# Altium schematic sheet G11_GPS-GSM.SCHDOC
size A3; SheetNumber: 0; SheetTotal: 0
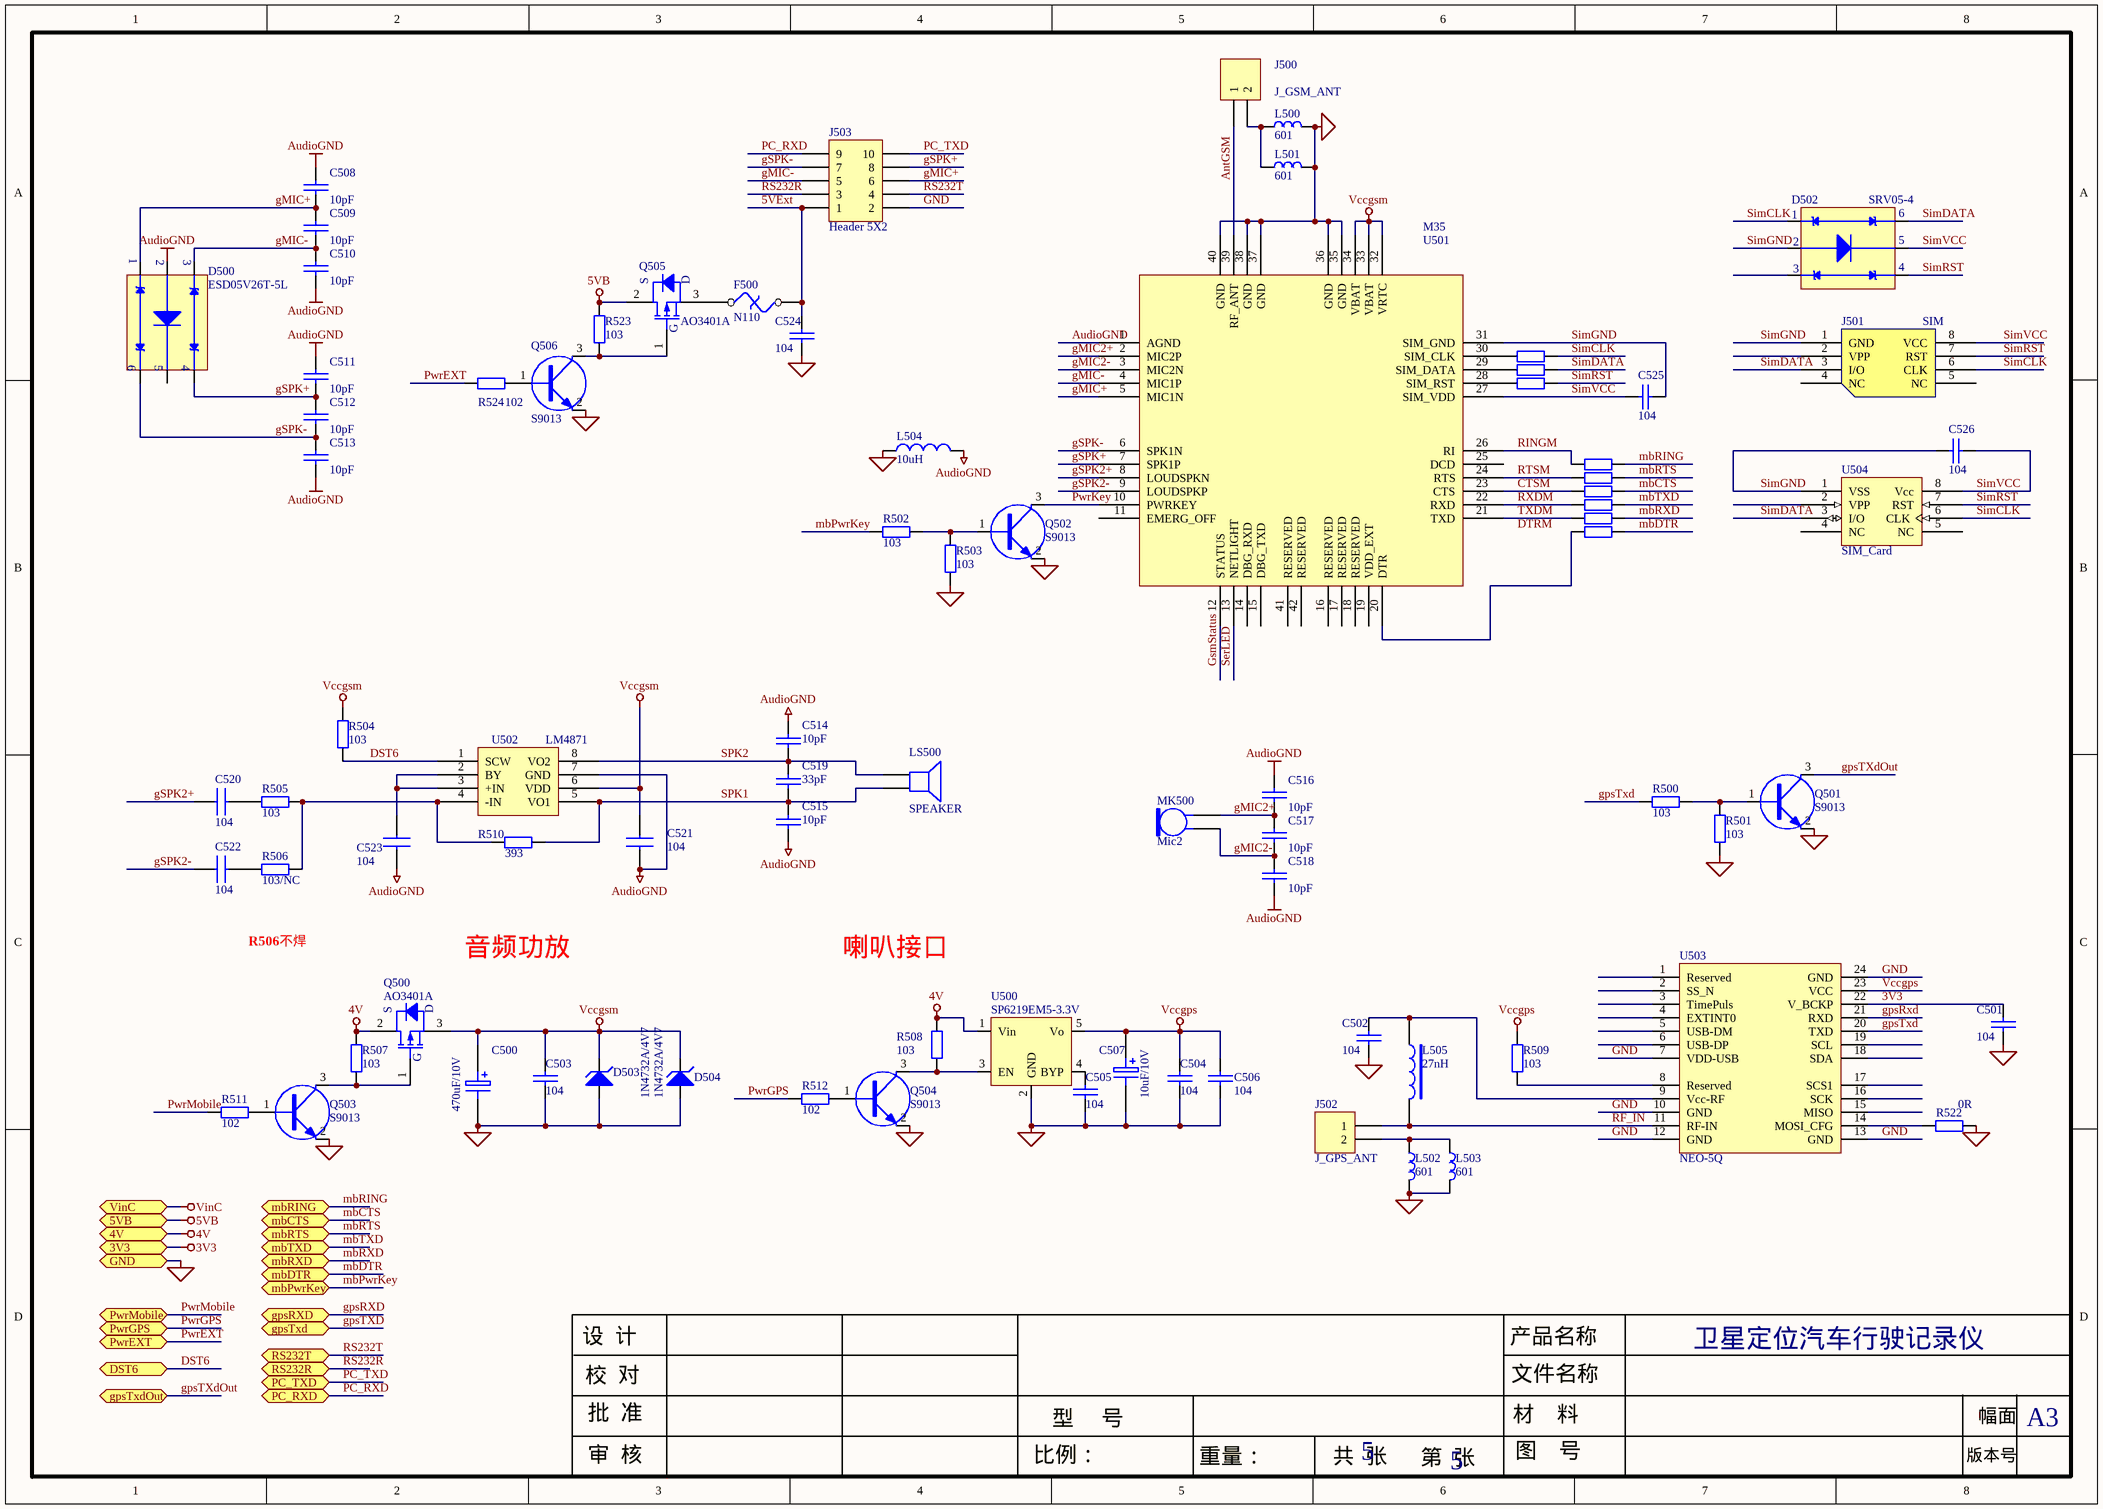
[diagram p0: G11_GPS-GSM.SCHDOC]

## Parts
C500  470uF/10V  [RB-3.5mm]
C501  104  [C0603]
C502  104  [C0603]
C503  104  [C0603]
C504  104  [C0603]
C505  104  [C0603]
C506  104  [C0603]
C507  10uF/10V  [A(3216)]
C508  10pF  [C0603]
C509  10pF  [C0603]
C510  10pF  [C0603]
C511  10pF  [C0603]
C512  10pF  [C0603]
C513  10pF  [C0603]
C514  10pF  [C0603]
C515  10pF  [C0603]
C516  10pF  [C0603]
C517  10pF  [C0603]
C518  10pF  [C0603]
C519  33pF  [C0603]
C520  104  [C0603]
C521  104  [C0603]
C522  104  [C0603]
C523  104  [C0603]
C524  104  [C0603]
C525  104  [C0603]
C526  104  [C0603]
D500  ESD05V26T-5L  [SOT-236]
D502  SRV05-4  [SOT-236]
D503  1N4732A/4V7  [D1206]
D504  1N4732A/4V7  [D1206]
F500  N110  [F0820]
J500  J_GSM_ANT  [ANT-SMA]
J501  SIM  [SIM3-8P]
J502  J_GPS_ANT  [ANT-SMA]
J503  Header 5X2  [HDR2X5-3MM]
L500  601  [0603]
L501  601  [0603]
L502  601  [0603]
L503  601  [0603]
L504  10uH  [0603]
L505  27nH  [0603]
LS500  SPEAKER  [BT-2.0]
MK500  Mic2  [BT-2.0]
Q500  AO3401A  [SOT-233PM]
Q501  S9013  [SOT-233]
Q502  S9013  [SOT-233]
Q503  S9013  [SOT-233]
Q504  S9013  [SOT-233]
Q505  AO3401A  [SOT-233PM]
Q506  S9013  [SOT-233]
R500  103  [R0603]
R501  103  [R0603]
R502  103  [R0603]
R503  103  [R0603]
R504  103  [R0603]
R505  103  [R0603]
R506  103/NC  [R0603]
R507  103  [R0603]
R508  103  [R0603]
R509  103  [R0603]
R510  393  [R0603]
R511  102  [R0603]
R512  102  [R0603]
R513  18R  [R0603]  (value not drawn)
R514  18R  [R0603]  (value not drawn)
R515  18R  [R0603]  (value not drawn)
R516  471  [R0603]  (value not drawn)
R517  471  [R0603]  (value not drawn)
R518  471  [R0603]  (value not drawn)
R519  471  [R0603]  (value not drawn)
R520  471  [R0603]  (value not drawn)
R521  471  [R0603]  (value not drawn)
R522  0R  [R0603]
R523  103  [R0603]
R524  102  [R0603]
U500  SP6219EM5-3.3V  [SOT-235]
U501  M35  [M35]
U502  LM4871  [SMD8A]
U503  NEO-5Q  [NEO-5Q]
U504  SIM_Card  [QFN5*6-8]

## Ports
3V3 (bidir), 4V (bidir), 5VB (bidir), DST6 (bidir), GND (bidir), gpsRXD (bidir), gpsTxd (bidir), gpsTxdOut (bidir), mbCTS (bidir), mbDTR (bidir), mbPwrKey (bidir), mbRING (bidir), mbRTS (bidir), mbRXD (bidir), mbTXD (bidir), PC_RXD (bidir), PC_TXD (bidir), PwrEXT (bidir), PwrGPS (bidir), PwrMobile (bidir), RS232R (bidir), RS232T (bidir), VinC (bidir)

## Nets
3V3: C501.1 U503.22(V_BCKP) ; port 3V3
4V: Q500.2(D) R507.1 R508.2 U500.1(Vin) ; port 4V
5VB: Q505.2(D) R523.1 ; port 5VB
AudioGND: C508.1 C510.2 C511.1 C513.2 C514.2 C515.1 C516.1 C518.2 C521.2 C523.2 D500.2 L504.2 U501.1(AGND) U502.7(GND)
GND: C500.2 C501.2 C502.2 C503.2 C504.2 C505.2 C506.1 C507.2 C524.2 D503.1(A) D504.1(A) J503.2 L500.2 L501.2 L502.2 L503.2 L504.1 Q501.2(E) Q502.2(E) Q503.2(E) Q504.2(E) Q506.2(E) R501.1 R503.1 R522.1 U500.2(GND) U501.35(GND) U501.36(GND) U501.37(GND) U501.38(GND) U501.40(GND) U503.7(VDD-USB) U503.10(GND) U503.12(GND) U503.13(GND) U503.24(GND) ; port GND
Vccgps: C504.1 C506.2 C507.1 R509.2 U500.5(Vo) U503.23(VCC)
Vccgsm: C500.1 C503.1 C521.1 D503.2(K) D504.2(K) Q500.3(S) R504.1 U501.32(VRTC) U501.33(VBAT) U501.34(VBAT) U502.6(VDD)
VinC: port VinC
5VExt: C524.1 F500.1 J503.1
AntGSM: J500.1 U501.39(RF_ANT)
CTSM: R518.1 U501.23(CTS)
DST6: R504.2 U502.1(SCW) ; port DST6
gMIC2+: C516.2 C517.1 MK500.1 U501.2(MIC2P)
gMIC2-: C517.2 C518.1 MK500.2 U501.3(MIC2N)
gMIC+: C508.2 C509.1 D500.1 J503.6 U501.5(MIC1N)
gMIC-: C509.2 C510.1 D500.3 J503.5 U501.4(MIC1P)
gpsRxd: U503.21(RXD) ; port gpsRXD
gpsTxd: R500.2 U503.20(TXD) ; port gpsTxd
gpsTXdOut: Q501.3(C) ; port gpsTxdOut
GsmStatus: U501.12(STATUS)
gSPK2+: C520.1 U501.8(LOUDSPKN)
gSPK2-: C522.1 U501.9(LOUDSPKP)
gSPK+: C511.2 C512.1 D500.4 J503.8 U501.7(SPK1P)
gSPK-: C512.2 C513.1 D500.6 J503.7 U501.6(SPK1N)
mbCTS: R518.2 ; port mbCTS
mbDTR: R521.2 ; port mbDTR
mbPwrKey: R502.2 ; port mbPwrKey
mbRING: R516.2 ; port mbRING
mbRTS: R517.2 ; port mbRTS
mbRXD: R520.2 ; port mbRXD
mbTXD: R519.2 ; port mbTXD
PC_RXD: J503.9 ; port PC_RXD
PC_TXD: J503.10 ; port PC_TXD
PwrEXT: R524.2 ; port PwrEXT
PwrGPS: R512.2 ; port PwrGPS
PwrKey: Q502.3(C) U501.10(PWRKEY)
PwrMobile: R511.2 ; port PwrMobile
RF_IN: J502.1 L505.1 U503.11(RF-IN)
RINGM: R516.1 U501.26(RI)
RS232R: J503.3 ; port RS232R
RS232T: J503.4 ; port RS232T
RTSM: R517.1 U501.24(RTS)
RXDM: R519.1 U501.22(RXD)
SerLED: U501.13(NETLIGHT)
SimCLK: D502.1 J501.6(CLK) R513.2 U504.6(CLK)
SimDATA: D502.6 J501.3(I/O) R514.2 U504.3(I/O)
SimGND: C525.2 C526.1 D502.2 J501.1(GND) U501.31(SIM_GND) U504.1(VSS)
SimRST: D502.4 J501.7(RST) R515.2 U504.7(RST)
SimVCC: C525.1 C526.2 D502.5 J501.8(VCC) U501.27(SIM_VDD) U504.8(Vcc)
SPK1: C515.2 C519.1 LS500.2 R510.2 U502.5(VO1)
SPK2: C514.1 C519.2 LS500.1 U502.8(VO2)
TXDM: R520.1 U501.21(TXD)
NetC502_1: C502.1 L505.2 U503.9(Vcc-RF)
NetC505_1: C505.1 U500.4(BYP)
NetC520_2: C520.2 R505.1
NetC522_2: C522.2 R506.1
NetC523_1: C523.1 U502.2(BY) U502.3(+IN)
NetF500_2: F500.2 Q505.3(S)
NetJ500_2: J500.2 L500.1 L501.1
NetJ502_2: J502.2 L502.1 L503.1
NetQ500_1: Q500.1(G) Q503.3(C) R507.2
NetQ501_1: Q501.1(B) R500.1 R501.2
NetQ502_1: Q502.1(B) R502.1 R503.2
NetQ503_1: Q503.1(B) R511.1
NetQ504_1: Q504.1(B) R512.1
NetQ504_3: Q504.3(C) R508.1 U500.3(EN)
NetQ505_1: Q505.1(G) Q506.3(C) R523.2
NetQ506_1: Q506.1(B) R524.1
NetR505_2: R505.2 R506.2 R510.1 U502.4(-IN)
NetR509_1: R509.1 U503.8(Reserved)
NetR513_1: R513.1 U501.30(SIM_CLK)
NetR514_1: R514.1 U501.29(SIM_DATA)
NetR515_1: R515.1 U501.28(SIM_RST)
NetR521_1: R521.1 U501.20(DTR)
NetR522_2: R522.2 U503.14(MOSI_CFG)

Not connected (* = marked no-connect by the designer): D500 5; D502 3; J501 2(VPP) 4(NC) 5(NC); U501 11(EMERG_OFF) 14(DBG_RXD) 15(DBG_TXD) 16(RESERVED) 17(RESERVED) 18(RESERVED) 19(VDD_EXT) 25(DCD) 41(RESERVED) 42(RESERVED); U503 1(Reserved) 2(SS_N) 3(TimePuls) 4(EXTINT0) 5(USB-DM) 6(USB-DP) 15(MISO) 16(SCK) 17(SCS1) 18(SDA) 19(SCL); U504 2(VPP) 4(NC) 5(NC)

## Notes on the sheet
- R506不焊
- 音频功放
- 喇叭接口
- 设  计
- 校  对
- 产品名称
- 文件名称
- 卫星定位汽车行驶记录仪
- 审  核
- 批  准
- 比例：
- 型     号
- 5
- 材    料
- 图    号
- 版本号
- 幅面
- A3
- 重量：
- 共  张
- 第  张
- Labels drawn without touching a wire or pin: DTRM

## Library data of the parts
C500 = ELECTRO1: 直插电解
C501-C506 C508-C513 C516-C519 C524-C526 = CAP: 贴片电容
  C506: C: 贴片电容
C507 = ELECTRO1: Electrolytic Capacitor
C514 C515 = CAP: Capacitor
C520-C523 = 04-02-01
D500 D502 = ESD4: 贴片ESD管; Manufacturer: Generic Components; Class: Discrete; SubClass: Diode - Zener; Published: 08/06/2000; Publisher: Altium Hobart Technology Centre
D503 D504 = D Zener: 贴片稳压管; Manufacturer: Generic Components; Class: Discrete; SubClass: Diode - Zener; Published: 08/06/2000; Publisher: Altium Hobart Technology Centre
F500 = THERMAL FUSE: 贴片自恢复保险丝; F: F
J500 = Header 2: GSM天线接口; Revision: 17-Jul-2002: Re-released for DXP Platform.; Publisher: Altium Limited
J501 = SIM_Card_Lock: 抽屉式SIM卡座
J502 = Header 2: GPS天线接口; Revision: 17-Jul-2002: Re-released for DXP Platform.; Publisher: Altium Limited
J503 = Header 5X2: Header, 5-Pin, Dual row; Revision: 17-Jul-2002: Re-released for DXP Platform.; Publisher: Altium Limited
L500-L503 = ChiZhu: 贴片磁珠; Manufacturer: Generic Components; Class: Passive; SubClass: Inductor; Published: 08/06/2000; Publisher: Altium Hobart Technology Centre; Value: 601
L504 = Inductor: 贴片电感; Manufacturer: Generic Components; Class: Passive; Published: 08/06/2000; Publisher: Altium Hobart Technology Centre; SubClass: Inductor; Value: 10uH
L505 = INDUCTOR2: 贴片电感; L: L
MK500 = Mic2: Microphone; Published: 24-Mar-1999; Revision: July-2002: Re-released for DXP Platform.; Publisher: Altium Limited
Q500 Q505 = MOSFET-P: 贴片P沟MOS管
Q501 Q502 = 9013: 贴片三极管
Q503 Q504 Q506 = 9013
R500-R503 R507 R508 R511-R521 R523 R524 = Res2: 贴片电阻; Manufacturer: Generic Components; Class: Passive; SubClass: Resistor; Value: 15K; Published: 08/06/2000; Publisher: Altium Hobart Technology Centre
R504-R506 R510 = Res2: Resistor; Manufacturer: Generic Components; Class: Passive; Value: 15K; Published: 08/06/2000; Publisher: Altium Hobart Technology Centre; SubClass: Resistor
R509 R522 = Res2: 贴片电阻; Manufacturer: Generic Components; Class: Passive; SubClass: Resistor; Value: 1K; Published: 08/06/2000; Publisher: Altium Hobart Technology Centre
U500 = SPX5205: 贴片电源LDO
U501 = M35: 贴片GPRS通讯模块
U502 = LM4871: 音频放大器
U503 = NEO-5Q: 定位模块
U504 = SIM_Card: 贴片SIM卡; FRAM: EEPROM WatchDog(贴片)